# EAGLE design old_control_panel (EAGLE 7.7.0)
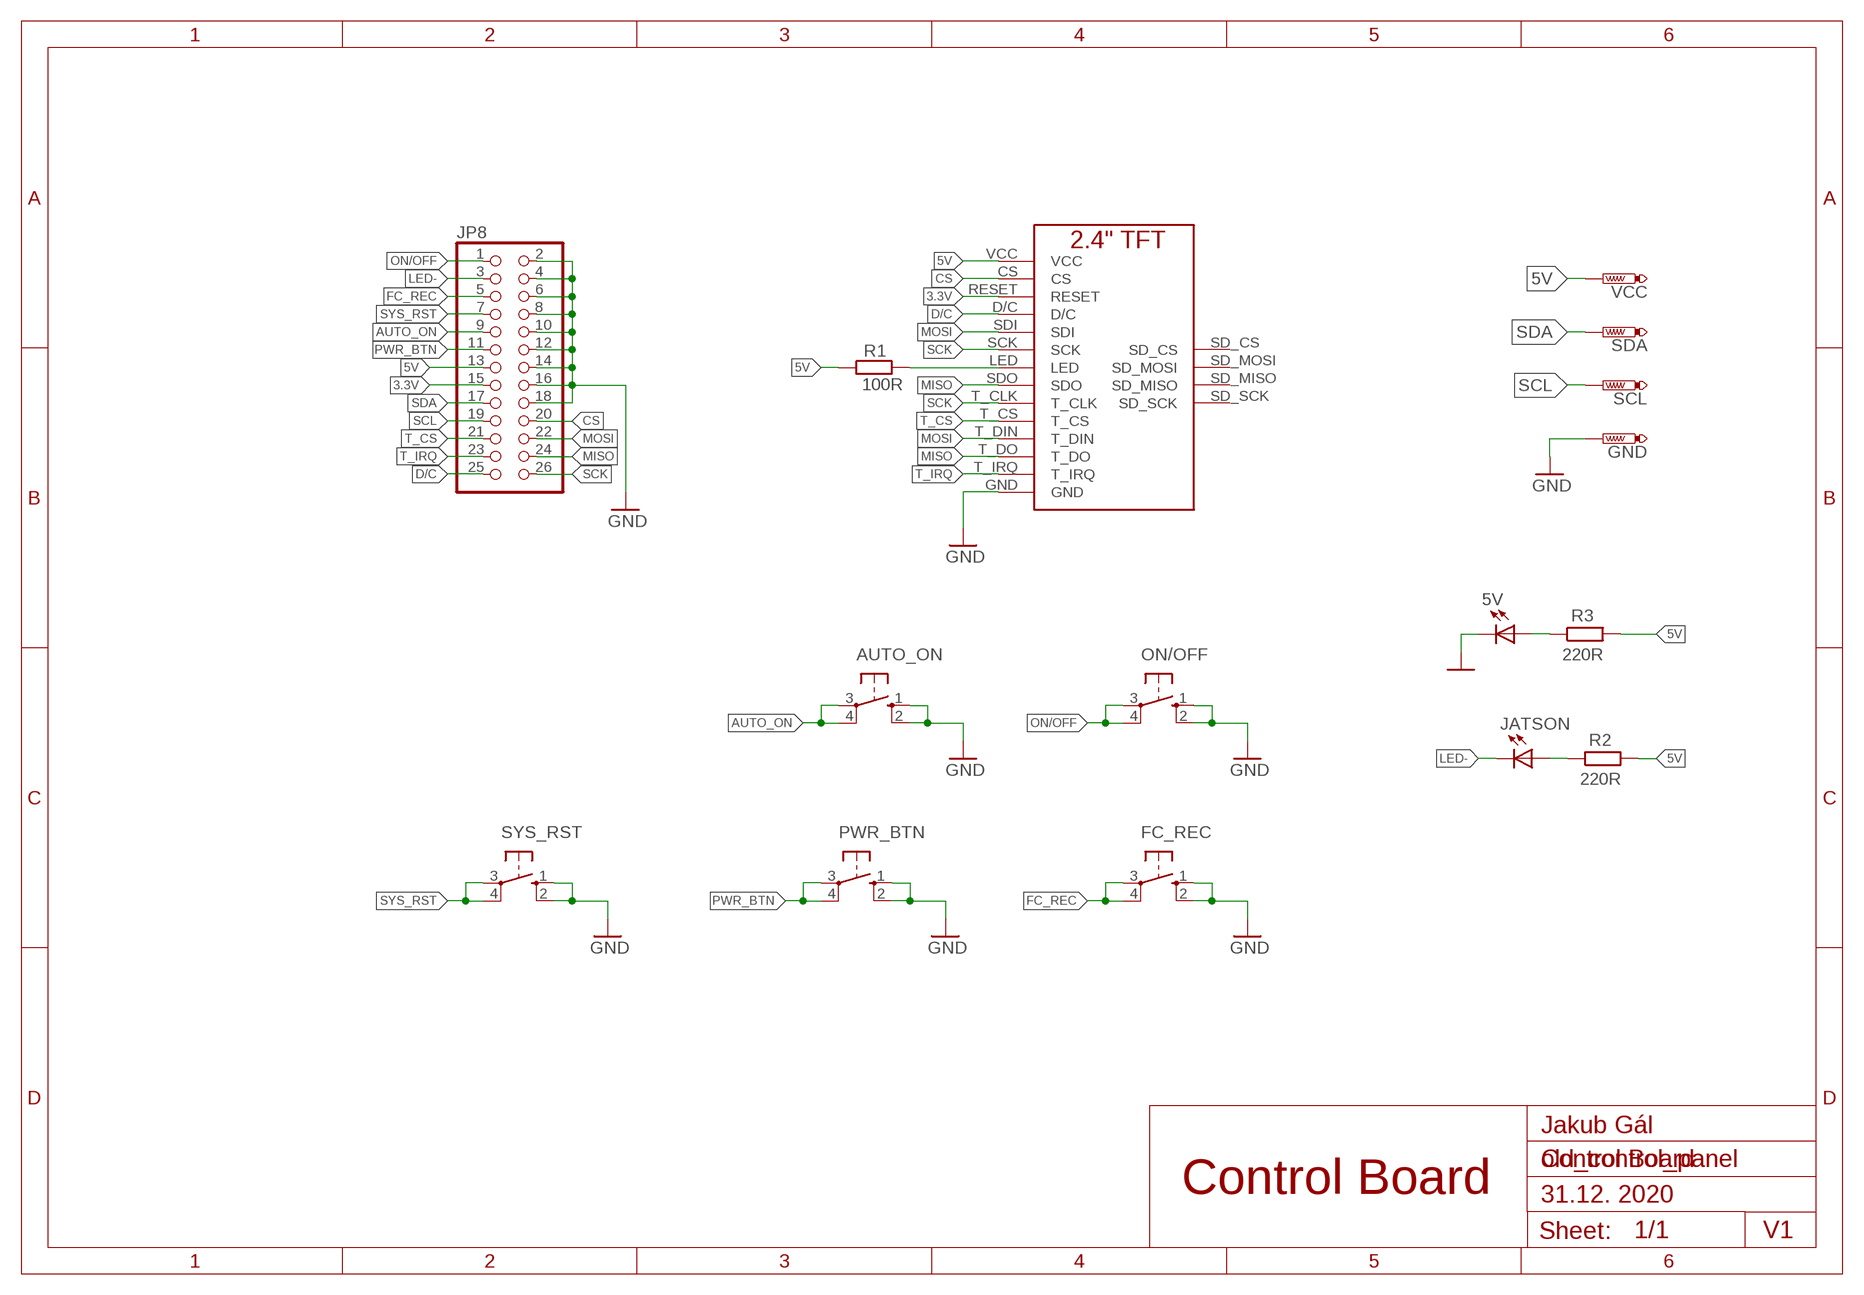
[diagram p0: schematic, sheet 1]

## Parts
5V  LEDCHIPLED_0603  [CHIPLED_0603]
AUTO_ON  10-XX  [B3F-10XX]
FC_REC  10-XX  [B3F-10XX]
GND  PTR1TP20R  [TP20R]
JATSON  LEDCHIPLED_0603  [CHIPLED_0603]
JP8  PINHD-2X13_2.54  [2X13]
ON/OFF  10-XX  [B3F-10XX]
PWR_BTN  10-XX  [B3F-10XX]
R1  100R  R-EU_R0603  [R0603]
R2  220R  R-EU_R0603  [R0603]
R3  220R  R-EU_R0603  [R0603]
SCL  PTR1TP20R  [TP20R]
SDA  PTR1TP20R  [TP20R]
SYS_RST  10-XX  [B3F-10XX]
U$1  2.4"TFT  [TFT_2.4"]
VCC  PTR1TP20R  [TP20R]

## Nets
3.3V: JP8.15 U$1.RESET
5V: JP8.13 R1.1 R2.2 R3.2 U$1.VCC VCC.TP
AUTO_ON: AUTO_ON.3(P) AUTO_ON.4(P1) JP8.9
CS: JP8.20 U$1.CS
D/C: JP8.25 U$1.D/C
FC_REC: FC_REC.3(P) FC_REC.4(P1) JP8.5
GND: 5V.C AUTO_ON.1(S) AUTO_ON.2(S1) FC_REC.1(S) FC_REC.2(S1) GND.TP JP8.2 JP8.4 JP8.6 JP8.8 JP8.10 JP8.12 JP8.14 JP8.16 JP8.18 ON/OFF.1(S) ON/OFF.2(S1) PWR_BTN.1(S) PWR_BTN.2(S1) SYS_RST.1(S) SYS_RST.2(S1) U$1.GND
LED-: JATSON.C JP8.3
MISO: JP8.24 U$1.SDO U$1.T_DO
MOSI: JP8.22 U$1.SDI U$1.T_DIN
N$1: R1.2 U$1.LED
N$2: JATSON.A R2.1
N$3: 5V.A R3.1
ON/OFF: JP8.1 ON/OFF.3(P) ON/OFF.4(P1)
PWR_BTN: JP8.11 PWR_BTN.3(P) PWR_BTN.4(P1)
SCK: JP8.26 U$1.SCK U$1.T_CLK
SCL: JP8.19 SCL.TP
SDA: JP8.17 SDA.TP
SYS_RST: JP8.7 SYS_RST.3(P) SYS_RST.4(P1)
T_CS: JP8.21 U$1.T_CS
T_IRQ: JP8.23 U$1.T_IRQ
Unconnected: U$1.SD_CS U$1.SD_MISO U$1.SD_MOSI U$1.SD_SCK

## Notes on the sheet
- Jakub Gál
- Control Board
- Control Board
- 31.12. 2020
- V1

## Library data of the parts
5V JATSON = audio amplifier example:LED
AUTO_ON FC_REC ON/OFF PWR_BTN SYS_RST = switch-omron:10-XX: OMRON SWITCH; MPN: B3F-1000; OC_FARNELL: 176432; OC_NEWARK: 36M3542
GND SCL SDA VCC = testpad:PTR1: TEST PIN
JP8 = pinhead-1:PINHD-2X13: PIN HEADER
R1-R3 = rcl:R-EU_: RESISTOR, European symbol; SPICEPREFIX: R
U$1 = TFT:2.4"TFT

## Board
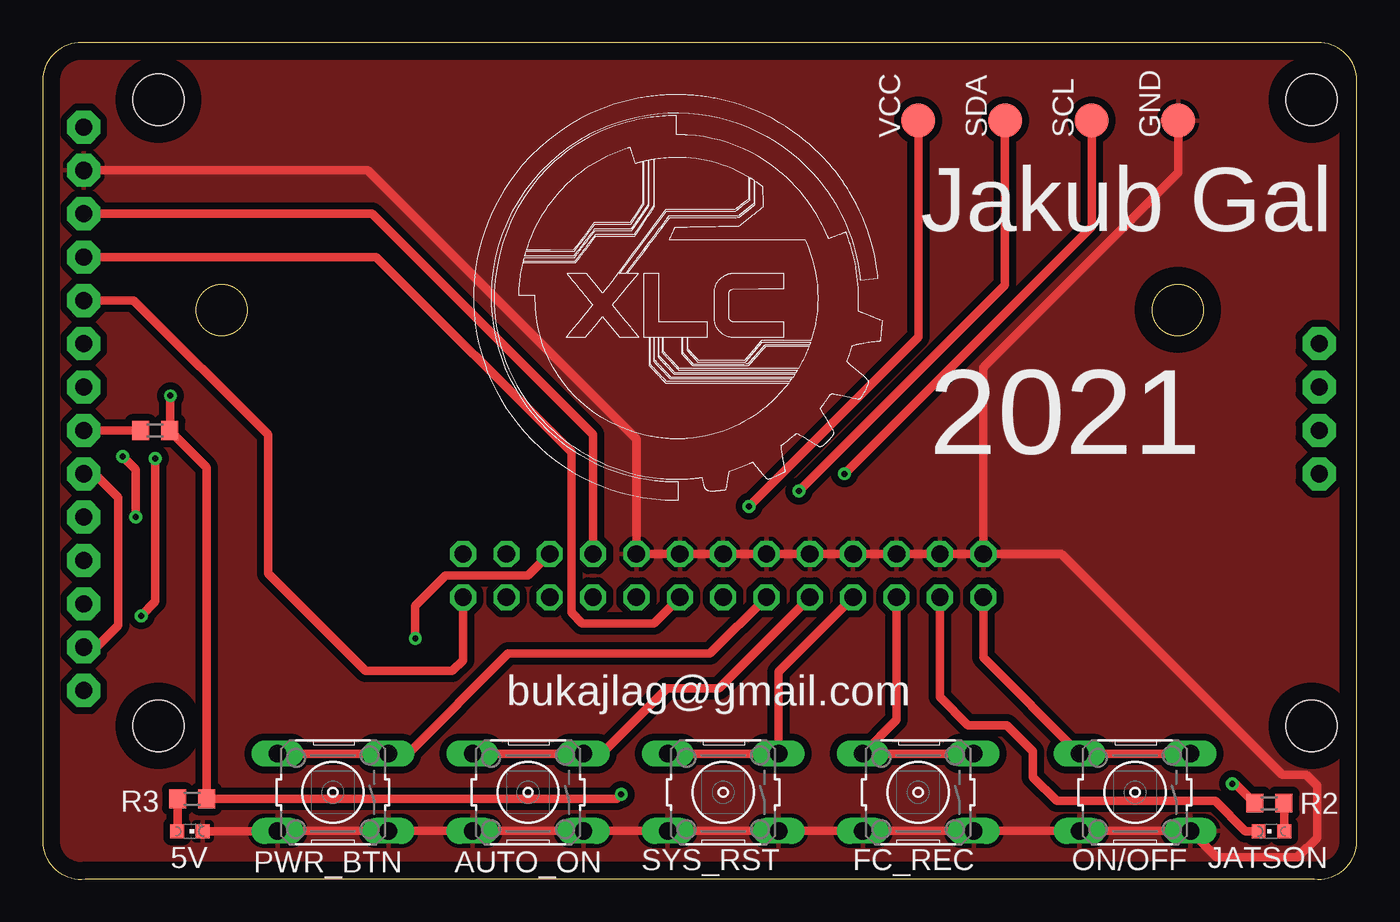
[diagram p1: board, top side]
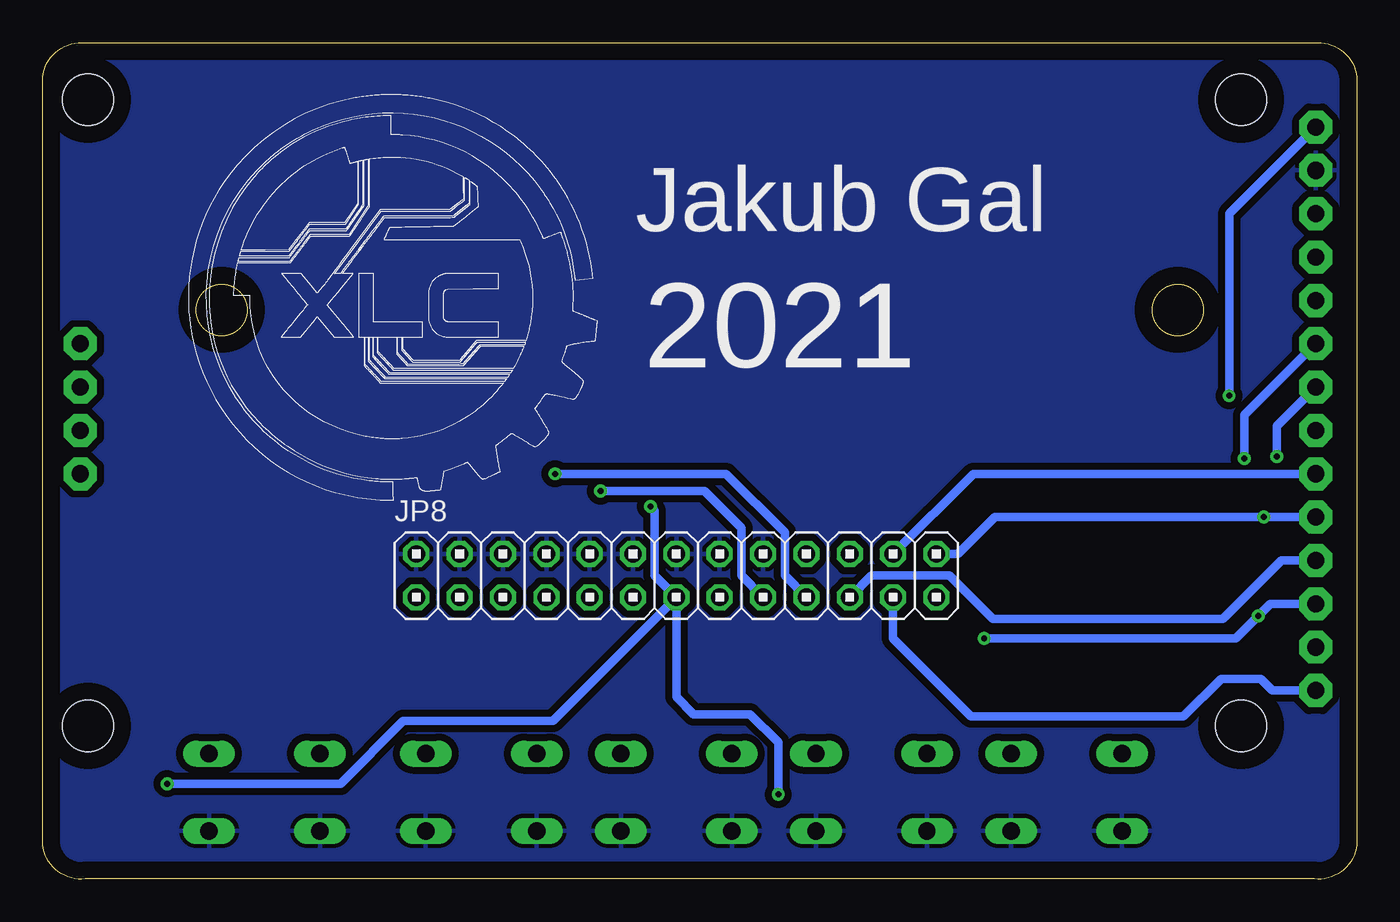
[diagram p2: board, bottom side, seen from below]

Size 77 x 49.03 mm. Coordinates in mm from the lower left corner, seen from the top.
Outline: 77,2.01 77,47.01 arc90 74.5,49.01 2.5,49.01 arc90 0,47.01 0,2.01 arc90 2.5,0.01 74.5,0.01 arc90 77,2.01
Outline: circle at 10.5,33.37 radius 1.5
Outline: circle at 66.5,33.37 radius 1.5
Copper layers (1*16): Top 0.035mm / dielectric 1.5mm / Bottom 0.035mm
Design rules "default": minimum track width 6mil, minimum drill 0.35mm, track to track 6mil, track to pad 6mil, pad to pad 6mil, via to via 6mil, smd to smd 6mil, copper to edge 40mil, drill to drill 6mil, minimum pad ring 10mil, minimum via ring 8mil, stop-mask expansion 4mil, vias tented up to drill 0mil, thermal gap 10mil

### Footprints (pad centres in the part's own frame; a part is rotated, then mirrored left to right if it is on the bottom)
CHIPLED_0603 = smd 0.8 x 0.8: A 0,-0.75; C 0,0.75
B3F-10XX = drill 1.016 long: 1 -3.251,2.261; 2 3.251,2.261; 3 -3.251,-2.261; 4 3.251,-2.261
TP20R = smd 2 x 2: TP 0,0
2X13 = drill 1.016 octagon: 1 -15.24,-1.27; 2 -15.24,1.27; 3 -12.7,-1.27; 4 -12.7,1.27; 5 -10.16,-1.27; 6 -10.16,1.27; 7 -7.62,-1.27; 8 -7.62,1.27; 9 -5.08,-1.27; 10 -5.08,1.27; 11 -2.54,-1.27; 12 -2.54,1.27; 13 0,-1.27; 14 0,1.27; 15 2.54,-1.27; 16 2.54,1.27; 17 5.08,-1.27; 18 5.08,1.27; 19 7.62,-1.27; 20 7.62,1.27; 21 10.16,-1.27; 22 10.16,1.27; 23 12.7,-1.27; 24 12.7,1.27; 25 15.24,-1.27; 26 15.24,1.27
R0603 = smd 1 x 1.1: 1 -0.85,0; 2 0.85,0
TFT_2.4" = drill 1 pad 1.93 octagon: CS 2.54,33.02; D/C 2.54,27.94; GND 2.54,35.56; LED 2.54,20.32; RESET 2.54,30.48; SCK 2.54,22.86; SD_CS 74.93,25.4; SD_MISO 74.93,20.32; SD_MOSI 74.93,22.86; SD_SCK 74.93,17.78; SDI 2.54,25.4; SDO 2.54,17.78; T_CLK 2.54,15.24; T_CS 2.54,12.7; T_DIN 2.54,10.16; T_DO 2.54,7.62; T_IRQ 2.54,5.08; VCC 2.54,38.1 | hole 3: 6.92,3; 74.48,3; 6.92,39.7; 74.48,39.7

### Placement (x,y rotation side)
5V  8.63,2.81 270 top
AUTO_ON  28.44,5.09 180 top
FC_REC  51.3,5.09 180 top
GND  66.54,44.46 90 top
JATSON  72,2.81 90 top
JP8  39.87,17.79 0 bottom
ON/OFF  64,5.09 180 top
PWR_BTN  17.01,5.09 180 top
R1  6.6,26.3 180 top
R2  71.87,4.46 180 top
R3  8.76,4.71 0 top
SCL  61.46,44.46 90 top
SDA  56.38,44.46 90 top
SYS_RST  39.87,5.09 180 top
U$1  -0.14,5.98 0 top
VCC  51.3,44.46 90 top

### Tracks (layer width: path | path; a pad name or v marks a point on that pad's centre or on a via)
3.3V
  Top 0.508: U$1.RESET 19.55,36.46 30.98,25.03 30.98,15.63 31.61,15 35.81,15 JP8.15
5V  (via drill 0.35)
  Top 0.508: R2.2 69.88,5.6 v69.72,5.6 | v33.9,4.97 33.65,4.71 R3.2 9.61,24.14 R1.1 7.49,26.34 v7.49,28.33 | VCC.TP 51.3,31.76 v41.39,21.86
  Bottom 0.508: v69.72,5.6 59.55,5.6 55.87,9.28 47.11,9.28 JP8.13 | v33.9,4.97 33.9,8.01 35.55,9.67 38.85,9.67 39.87,10.68 JP8.13 | U$1.VCC 7.49,39 v7.49,28.33 | v41.39,21.86 41.14,21.6 41.14,17.79 JP8.13
AUTO_ON
  Top 0.508: AUTO_ON.4 AUTO_ON.3 32.73,7.35 36.57,11.19 39.62,11.19 JP8.9
CS
  Top 0.508: JP8.20 32.25,26.05 19.3,39 U$1.CS
D/C
  Top 0.508: JP8.25 24.63,12.84 24,12.21 18.91,12.21 13.2,17.92 13.2,26.05 5.33,33.92 U$1.D/C
FC_REC
  Top 0.508: FC_REC.3 FC_REC.4 50.03,9.34 JP8.5
GND
  Top 0.508: 5V.C 13.73,2.81 PWR_BTN.2 PWR_BTN.1 AUTO_ON.2 AUTO_ON.1 SYS_RST.2 SYS_RST.1 FC_REC.2 FC_REC.1 ON/OFF.2 ON/OFF.1 68.8,1.28 73.53,1.28 74.67,2.43 74.67,5.47 74.03,6.11 72.64,6.11 59.68,19.06 JP8.2 | JP8.2 JP8.4 JP8.6 JP8.8 JP8.10 JP8.12 JP8.14 JP8.16 JP8.18 34.79,25.79 19.04,41.54 U$1.GND | GND.TP 66.54,41.42 55.11,29.99 JP8.2
  pour Top (isolate 0.406): 0,47.01 0,2.01 arc90 2.5,0.01 74.5,0.01 arc90 77,2.01 77,47.01 arc90 74.5,49.01 2.5,49.01 arc90
  pour Bottom (isolate 0.406): 0,47.01 0,2.01 arc90 2.5,0.01 74.5,0.01 arc90 77,2.01 77,47.01 arc90 74.5,49.01 2.5,49.01 arc90
LED-
  Top 0.508: JP8.3 52.57,10.68 54.22,9.03 56.51,9.03 58.03,7.51 58.03,5.98 59.43,4.59 68.7,4.59 70.48,2.81 JATSON.C
MISO
  Top 0.508: U$1.T_DO 3.17,13.6 4.44,14.87 4.44,22.37 3.04,23.76 U$1.SDO
  Bottom 0.508: U$1.SDO 22.47,23.76 JP8.24
MOSI  (via drill 0.35)
  Top 0.508: v21.84,14.11 21.84,16.02 23.61,17.79 28.44,17.79 JP8.22 | v6.6,24.65 6.6,16.27 v5.77,15.44
  Bottom 0.508: U$1.T_DIN 5.07,16.14 v5.77,15.44 7.1,14.11 v21.84,14.11 | U$1.SDI 6.6,27.19 v6.6,24.65
N$1
  Top 0.508: U$1.LED R1.2
N$2
  Top 0.508: R2.1 72.75,4.43 JATSON.A
N$3
  Top 0.508: 5V.A 7.91,2.83 R3.1
ON/OFF
  Top 0.508: ON/OFF.3 ON/OFF.4 55.11,12.99 JP8.1
PWR_BTN
  Top 0.508: PWR_BTN.4 PWR_BTN.3 21.4,7.35 27.27,13.22 39.11,13.22 JP8.11
SCK  (via drill 0.35)
  Top 0.508: v4.69,24.78 5.45,24.02 v5.45,21.22
  Bottom 0.508: JP8.26 23.36,19.06 21.2,21.22 v5.45,21.22 U$1.T_CLK | U$1.SCK 4.69,26.56 v4.69,24.78
SCL  (via drill 0.35)
  Top 0.508: v46.98,23.76 61.46,38.24 SCL.TP
  Bottom 0.508: JP8.19 33.52,17.79 33.52,20.33 36.95,23.76 v46.98,23.76
SDA  (via drill 0.35)
  Top 0.508: SDA.TP 56.38,34.81 v44.31,22.75
  Bottom 0.508: v44.31,22.75 38.22,22.75 36.06,20.59 36.06,17.79 JP8.17
SYS_RST
  Top 0.508: JP8.7 43.12,12.15 SYS_RST.3 SYS_RST.4
T_CS
  Bottom 0.508: JP8.21 28.44,17.79 23.87,17.79 21.33,15.25 7.87,15.25 4.44,18.68 U$1.T_CS
T_IRQ
  Bottom 0.508: JP8.23 27.17,14.11 22.6,9.54 10.15,9.54 7.94,11.75 5.64,11.75 4.95,11.06 U$1.T_IRQ

### Text on the board
tNames: Jakub Gal | 2021 | bukajlag@gmail.com
bNames: Jakub Gal | 2021